# Altium schematic sheet Buttons.SchDoc: Gomb illesztések
size A4; DocumentNumber: 2; SheetNumber: 2; SheetTotal: 4
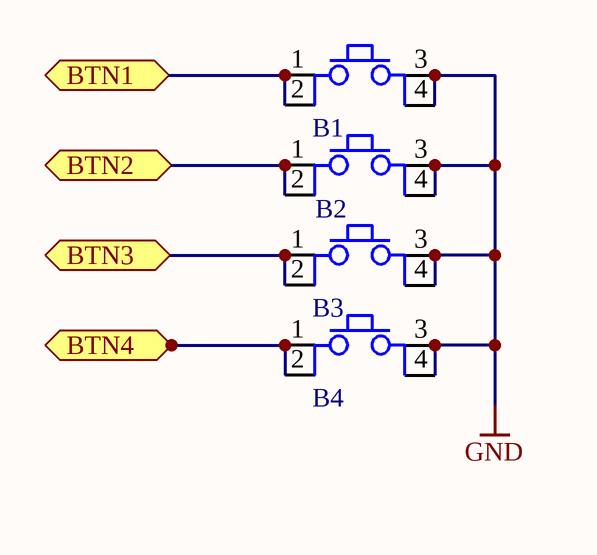
[diagram p0: Buttons.SchDoc]

## Parts
B1  Button  [FP_BTN_SMD]  (value not drawn)
B2  Button  [FP_BTN_SMD]  (value not drawn)
B3  Button  [FP_BTN_SMD]  (value not drawn)
B4  Button  [FP_BTN_SMD]  (value not drawn)

## Ports
BTN1 (bidir), BTN2 (bidir), BTN3 (bidir), BTN4 (bidir)

## Nets
GND: B1.3 B1.4 B2.3 B2.4 B3.3 B3.4 B4.3 B4.4
BTN1: B1.1 B1.2 ; port BTN1
BTN2: B2.1 B2.2 ; port BTN2
BTN3: B3.1 B3.2 ; port BTN3
BTN4: B4.1 B4.2 ; port BTN4

## Notes on the sheet
- Title
- Size:
- Date:
- A4
- Number:
- Time:
- Revision:
- Sheet
- of
- File:

## Library data of the parts
B1-B4 = Button 4P: Push button; Reference: 2610937; Name: ALCOSWITCH - TE CONNECTIVITY FSM1LPTR; Supplier: Farnell